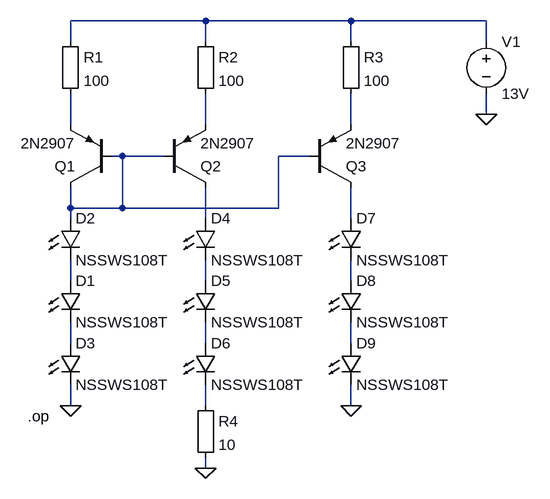
[diagram p0: schematic Draft1.asc]
Draft1.asc, the LTspice schematic file:
Version 4
SHEET 1 880 732
WIRE 336 -32 128 -32
WIRE 560 -32 336 -32
WIRE 768 -32 560 -32
WIRE 128 0 128 -32
WIRE 336 0 336 -32
WIRE 560 0 560 -32
WIRE 768 0 768 -32
WIRE 768 112 768 80
WIRE 128 128 128 80
WIRE 336 128 336 80
WIRE 560 128 560 80
WIRE 208 176 192 176
WIRE 272 176 208 176
WIRE 496 176 448 176
WIRE 128 256 128 224
WIRE 208 256 208 176
WIRE 208 256 128 256
WIRE 448 256 448 176
WIRE 448 256 208 256
WIRE 128 272 128 256
WIRE 336 272 336 224
WIRE 560 272 560 224
WIRE 128 368 128 336
WIRE 336 368 336 336
WIRE 560 368 560 336
WIRE 128 464 128 432
WIRE 336 464 336 432
WIRE 560 464 560 432
WIRE 128 560 128 528
WIRE 336 560 336 528
WIRE 560 560 560 528
WIRE 336 656 336 640
FLAG 128 560 0
FLAG 336 656 0
FLAG 560 560 0
FLAG 768 112 0
SYMBOL pnp 192 224 R180
SYMATTR InstName Q1
SYMATTR Value 2N2907
SYMBOL pnp 272 224 M180
SYMATTR InstName Q2
SYMATTR Value 2N2907
SYMBOL Misc\\EuropeanResistor 112 -16 R0
SYMATTR InstName R1
SYMATTR Value 100
SYMBOL Misc\\EuropeanResistor 320 -16 R0
SYMATTR InstName R2
SYMATTR Value 100
SYMBOL LED 112 464 R0
SYMATTR InstName D3
SYMATTR Value NSSWS108T
SYMATTR Description Diode
SYMATTR Type diode
SYMBOL LED 320 464 R0
SYMATTR InstName D6
SYMATTR Value NSSWS108T
SYMATTR Description Diode
SYMATTR Type diode
SYMBOL pnp 496 224 M180
SYMATTR InstName Q3
SYMATTR Value 2N2907
SYMBOL Misc\\EuropeanResistor 544 -16 R0
SYMATTR InstName R3
SYMATTR Value 100
SYMBOL LED 544 464 R0
SYMATTR InstName D9
SYMATTR Value NSSWS108T
SYMATTR Description Diode
SYMATTR Type diode
SYMBOL voltage 768 -16 R0
WINDOW 123 0 0 Left 0
WINDOW 39 0 0 Left 0
SYMATTR InstName V1
SYMATTR Value 13V
SYMBOL LED 112 368 R0
SYMATTR InstName D1
SYMATTR Value NSSWS108T
SYMATTR Description Diode
SYMATTR Type diode
SYMBOL LED 112 272 R0
SYMATTR InstName D2
SYMATTR Value NSSWS108T
SYMATTR Description Diode
SYMATTR Type diode
SYMBOL LED 320 272 R0
SYMATTR InstName D4
SYMATTR Value NSSWS108T
SYMATTR Description Diode
SYMATTR Type diode
SYMBOL LED 320 368 R0
SYMATTR InstName D5
SYMATTR Value NSSWS108T
SYMATTR Description Diode
SYMATTR Type diode
SYMBOL LED 544 272 R0
SYMATTR InstName D7
SYMATTR Value NSSWS108T
SYMATTR Description Diode
SYMATTR Type diode
SYMBOL LED 544 368 R0
SYMATTR InstName D8
SYMATTR Value NSSWS108T
SYMATTR Description Diode
SYMATTR Type diode
SYMBOL Misc\\EuropeanResistor 320 544 R0
SYMATTR InstName R4
SYMATTR Value 10
TEXT 62 576 Left 2 !.op

The netlist it stands for:
* Draft1.asc
Q1 N005 N005 N002 0 2N2907
Q2 N006 N005 N003 0 2N2907
R1 N001 N002 100
R2 N001 N003 100
D3 N011 0 NSSWS108T
D6 N012 N014 NSSWS108T
Q3 N007 N005 N004 0 2N2907
R3 N001 N004 100
D9 N013 0 NSSWS108T
V1 N001 0 13V
D1 N008 N011 NSSWS108T
D2 N005 N008 NSSWS108T
D4 N006 N009 NSSWS108T
D5 N009 N012 NSSWS108T
D7 N007 N010 NSSWS108T
D8 N010 N013 NSSWS108T
R4 N014 0 10
.model D D
.lib standard.dio
.model NPN NPN
.model PNP PNP
.lib standard.bjt
.op
.backanno
.end